# Altium project Lighting_Control_Board.PrjPcb
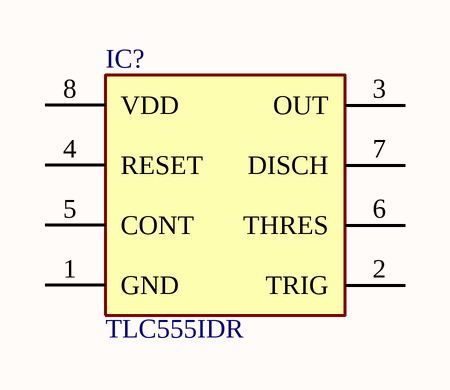
[diagram p0: Microcontroller.SchDoc]
1 sheet, 1 parts. Net scope: global (net labels, ports and power ports of the same name join across sheets).

## Sheet Microcontroller.SchDoc
size A; SheetNumber: 1; SheetTotal: 1

### Parts
IC?  TLC555IDR  [SOIC127P600X175-8N]

### Nets

Not connected (* = marked no-connect by the designer): IC? 1(GND) 2(TRIG) 3(OUT) 4(RESET) 5(CONT) 6(THRES) 7(DISCH) 8(VDD)

### Library data of the parts
IC? = TLC555IDR: 555 Timer; Manufacturer_Name: Texas Instruments; Datasheet Link: https://datasheet.datasheetarchive.com/originals/distributors/Datasheets-302/21491.pdf; Height: 1.75mm; Manufacturer_Part_Number: TLC555IDR; Mouser Part Number: 595-TLC555IDR; Mouser Price/Stock: https://www.mouser.co.uk/ProductDetail/Texas-Instruments/TLC555IDR?qs=gb35HGp1gQLSMPEbAnVEPg%3D%3D; Arrow Part Number: TLC555IDR; Arrow Price/Stock: https://www.arrow.com/en/products/tlc555idr/texas-instruments.html?utm_currency=USD&region=nac